# EAGLE design Stazione_Meteo (EAGLE 7.4.0)
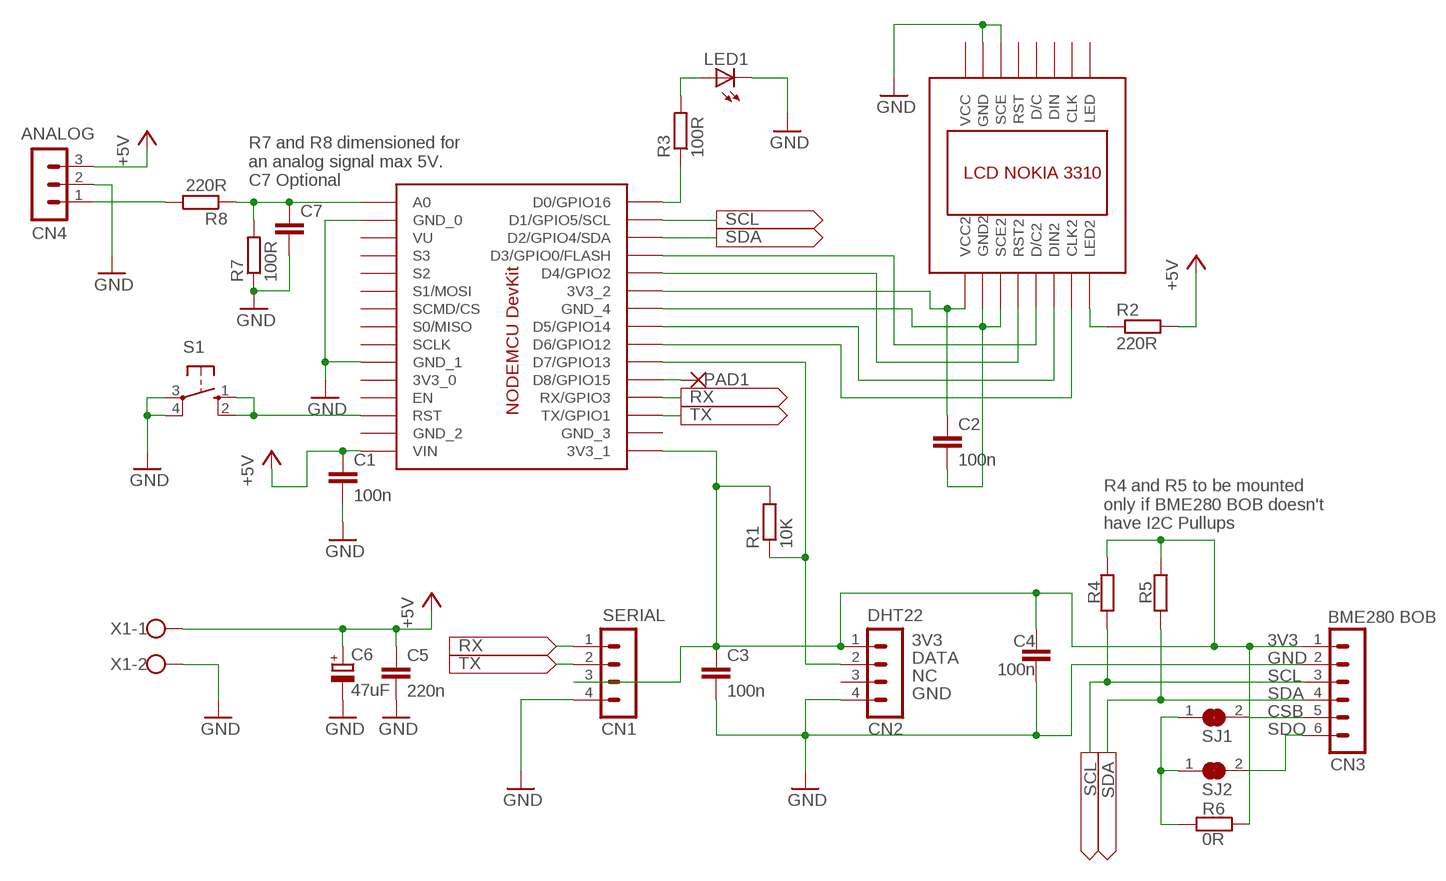
[diagram p0: schematic, sheet 1]

## Parts
C1  100n  C-EU025-024X044  [C025-024X044]
C2  100n  C-EU025-024X044  [C025-024X044]
C3  100n  C-EU025-024X044  [C025-024X044]
C4  100n  C-EU025-024X044  [C025-024X044]
C5  220n  C-EU025-024X044  [C025-024X044]
C6  47uF  CPOL-EUE2,5-6E  [E2,5-6E]
C7  C-EU025-024X044  [C025-024X044]
CN1  MA04-1  [MA04-1]
CN2  MA04-1  [MA04-1]
CN3  MA06-1  [MA06-1]
CN4  MA03-1  [MA03-1]
LED1  LED5MM  [LED5MM]
PAD1  1,6/0,9  [1,6/0,9]
R1  10K  R-EU_0204/7  [0204/7]
R2  220R  R-EU_0204/7  [0204/7]
R3  100R  R-EU_0204/7  [0204/7]
R4  R-EU_0204/7  [0204/7]
R5  R-EU_0204/7  [0204/7]
R6  0R  R-EU_0204/7  [0204/7]
R7  100R  R-EU_0204/7  [0204/7]
R8  220R  R-EU_0204/7  [0204/7]
S1  10-XX  [B3F-10XX]
SJ1  SJ  [SJ]
SJ2  SJ  [SJ]
U$1  NODEMCU_DEVKIT  [NODEMCU_DEVKIT]
U$2  NOKIA_3310/5110_BOB  [NOKIA_3310/5110_BOB]
X1  W237-102  [W237-102]

## Nets
+5V: C1.1 C5.1 C6.+ CN4.3 R2.2 U$1.VIN X1.1
GND: C1.2 C3.2 C4.2 C5.2 C6.- C7.2 CN1.4 CN2.4 CN3.2 CN4.2 LED1.K(C) R7.1 S1.3(P) S1.4(P1) U$1.GND0(GND_0) U$1.GND1(GND_1) U$2.GND U$2.SCE X1.2
N$1: R3.1 U$1.D0/GPIO16
N$2: LED1.A R3.2
N$3: CN2.2 R1.1 U$1.D7/GPIO13
N$4: S1.1(S) S1.2(S1) U$1.RST
N$6: R2.1 U$2.LED2
N$7: U$1.D5/GPIO14 U$2.DIN2
N$8: U$1.D3/GPIO0(D3/GPIO0/FLASH) U$2.D/C2
N$9: U$1.D4/GPIO2 U$2.RST2
N$10: C2.1 U$1.3V3_2 U$2.VCC2
N$11: U$1.D6/GPIO12 U$2.CLK2
N$12: R6.2 SJ1.1 SJ2.1
N$13: C2.2 U$1.GND4(GND_4) U$2.GND2 U$2.SCE2
N$14: PAD1.1(P) U$1.D8/GPIO15
N$15: CN3.5 SJ1.2
N$16: CN3.6 SJ2.2
N$19: C3.1 C4.1 CN1.3 CN2.1 CN3.1 R1.2 R4.2 R5.2 R6.1 U$1.3V3_1
N$21: CN4.1 R8.2
N$23: C7.1 R7.2 R8.1 U$1.A0
RX: CN1.1 U$1.RX/GPIO3
SCL: CN3.3 R4.1 U$1.D1/GPIO5(D1/GPIO5/SCL)
SDA: CN3.4 R5.1 U$1.D2/GPIO4(D2/GPIO4/SDA)
TX: CN1.2 U$1.TX/GPIO1
Unconnected: CN2.3 U$1.EN U$1.S0(S0/MISO) U$1.S1(S1/MOSI) U$1.S2 U$1.S3 U$1.SC(SCLK) U$1.SK(SCMD/CS) U$1.VU U$2.CLK U$2.D/C U$2.DIN U$2.RST

## Notes on the sheet
- ANALOG
- R7 and R8 dimensioned for
  an analog signal max 5V.
  C7 Optional
- R4 and R5 to be mounted
  only if BME280 BOB doesn't
  have I2C Pullups
- SERIAL | DHT22 | BME280 BOB
- 3V3 | 3V3
- DATA | GND
- NC | SCL
- GND | SDA
- CSB
- SDO

## Power pins joined to a net without a drawn wire
3V3_0: U$1.3V3_0
GND_2: U$1.GND2(GND_2)
GND_3: U$1.GND3(GND_3)
LED: U$2.LED
VCC: U$2.VCC

## Library data of the parts
C1-C5 C7 = rcl:C-EU: CAPACITOR, European symbol
C6 = rcl:CPOL-EU: POLARIZED CAPACITOR, European symbol
CN1 CN2 = con-lstb:MA04-1: PIN HEADER; OC_FARNELL: unknown; OC_NEWARK: unknown
CN3 = con-lstb:MA06-1: PIN HEADER; OC_FARNELL: unknown; OC_NEWARK: unknown
CN4 = con-lstb:MA03-1: PIN HEADER; OC_FARNELL: unknown; OC_NEWARK: unknown
LED1 = led:LED: LED OSRAM: - CHIPLED LG R971, LG N971, LY N971, LG Q971, LY Q971, LO R971, LY R971 LH N974, LH R974 LS Q976, LO Q976, LY Q976 LO Q996 - Hyper CHIPLED LW Q18S LB Q993, LB Q99A, LB R99A - SideLED LS A670, LO A670, LY A670, LG A670, LP A670 LB A673, LV A673, LT A673, LW A673 LH A674 LY A675 LS A676, LA A676, LO A676, LY A676, LW A676 LS A679, LY A679, LG A679 - Hyper Micro SIDELED® LS Y876, LA Y876, LO Y876, LY Y876 LT Y87S - SmartLED LW L88C, LW L88S LB L89C, LB L89S, LG L890 LS L89K, LO L89K, LY L89K LS L896, LA L896, LO L896, LY L896 - TOPLED LS T670, LO T670, LY T670, LG T670, LP T670 LSG T670, LSP T670, LSY T670, LOP T670, LYG T670 LG T671, LOG T671, LSG T671 LB T673, LV T673, LT T673, LW T673 LH T674 LS T676, LA T676, LO T676, LY T676, LB T676, LH T676, LSB T676, LW T676 LB T67C, LV T67C, LT T67C, LS T67K, LO T67K, LY T67K, LW E67C LS E67B, LA E67B, LO E67B, LY E67B, LB E67C, LV E67C, LT E67C LW T67C LS T679, LY T679, LG T679 LS T770, LO T770, LY T770, LG T770, LP T770 LB T773, LV T773, LT T773, LW T773 LH T774 LS E675, LA E675, LY E675, LS T675 LS T776, LA T776, LO T776, LY T776, LB T776 LHGB T686 LT T68C, LB T68C - Hyper Mini TOPLED® LB M676 - Mini TOPLED Santana® LG M470 LS M47K, LO M47K, LY M47K Source: http://www.osram.convergy.de LUXEON: - LUMILED® LXK2-PW12-R00, LXK2-PW12-S00, LXK2-PW14-U00, LXK2-PW14-V00 LXK2-PM12-R00, LXK2-PM12-S00, LXK2-PM14-U00 LXK2-PE12-Q00, LXK2-PE12-R00, LXK2-PE12-S00, LXK2-PE14-T00, LXK2-PE14-U00 LXK2-PB12-K00, LXK2-PB12-L00, LXK2-PB12-M00, LXK2-PB14-N00, LXK2-PB14-P00, LXK2-PB14-Q00 LXK2-PR12-L00, LXK2-PR12-M00, LXK2-PR14-Q00, LXK2-PR14-R00 LXK2-PD12-Q00, LXK2-PD12-R00, LXK2-PD12-S00 LXK2-PH12-R00, LXK2-PH12-S00 LXK2-PL12-P00, LXK2-PL12-Q00, LXK2-PL12-R00 Source: www.luxeon.com KINGBRIGHT: KA-3528ASYC Source: www.kingbright.com
PAD1 = wirepad:1,6/0,9: THROUGH-HOLE PAD
R1-R8 = rcl:R-EU_: RESISTOR, European symbol
S1 = switch-omron:10-XX: OMRON SWITCH; MPN: B3F-1000; OC_FARNELL: 176432; OC_NEWARK: 36M3542
SJ1 SJ2 = jumper:SJ: SMD solder JUMPER
U$1 = NodeMCU_devkit:NODEMCU_DEVKIT: NodeMCU LUA Devkit Version 0.1 Type 30x57mm with CH340G serial adapter Design by Giovanni Bernardo www.settorezero.com
U$2 = LCD_NOKIA_3310-5110_BreakoutBoard:NOKIA_3310/5110_BOB: LCD NOKIA 3310/5110 Breakout Board PCD8544 Controller Design by Giovanni Bernardo www.settorezero.com
X1 = con-wago-500:W237-102: WAGO SCREW CLAMP; MPN: 237-102; OC_FARNELL: unknown; OC_NEWARK: 70K9898

## Board
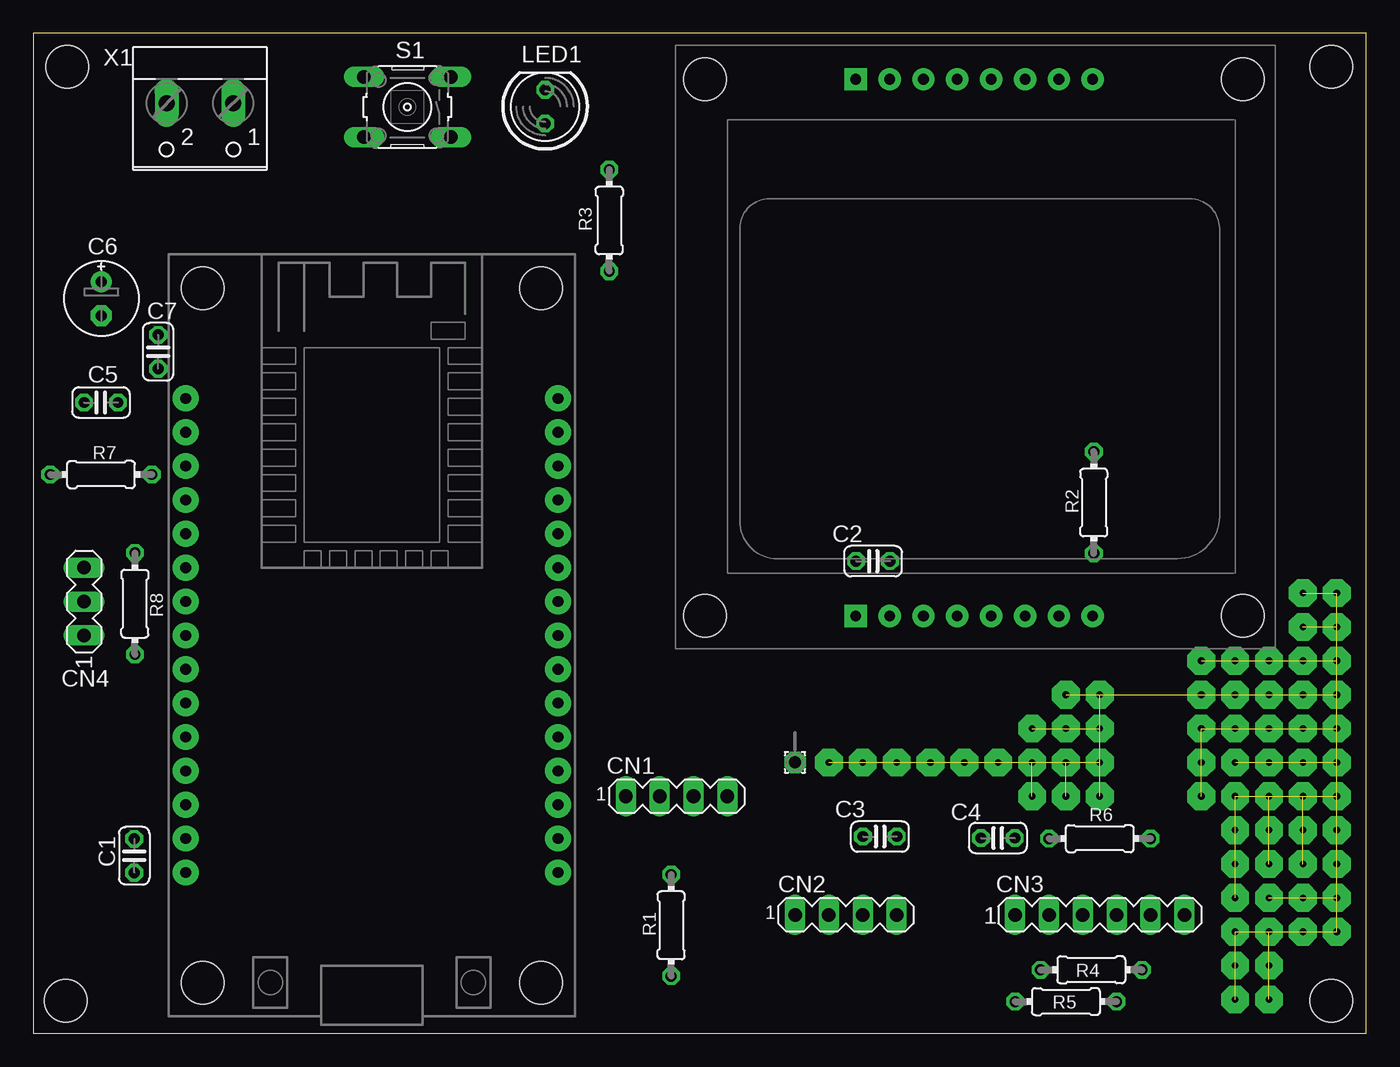
[diagram p1: board, top side]
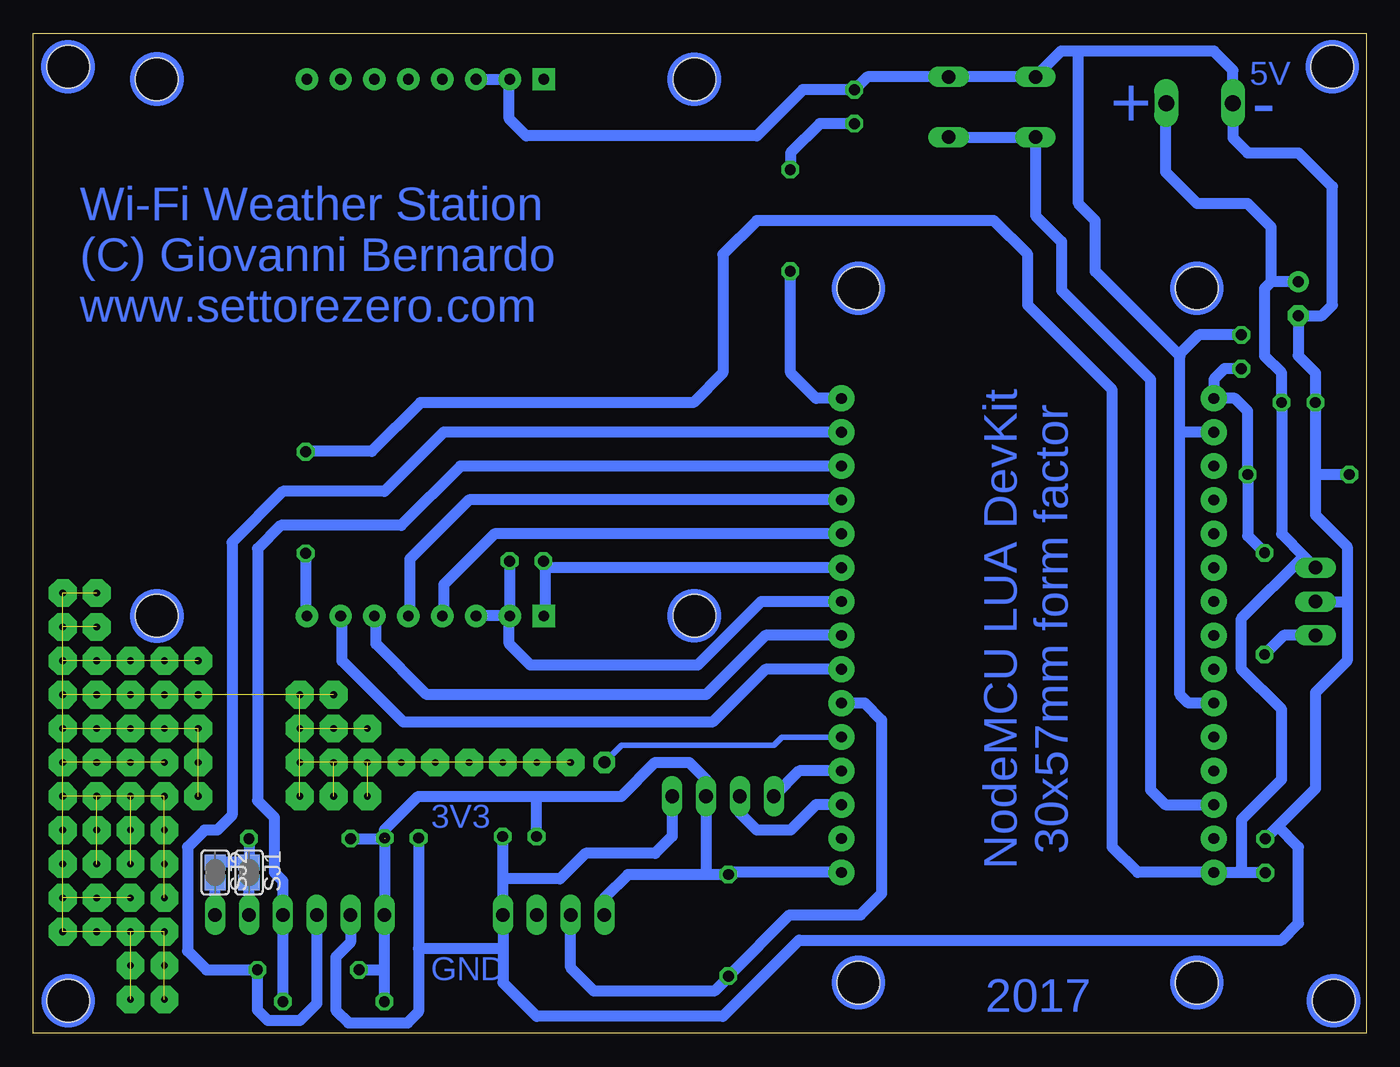
[diagram p2: board, bottom side, seen from below]

Size 100 x 75 mm. Coordinates in mm from the lower left corner, seen from the top.
Outline: 0,0 100,0 100,75 0,75 0,0
Copper layers (1*16): Top 0.035mm / dielectric 1.5mm / Bottom 0.035mm
Design rules "default": minimum track width 10mil, minimum drill 24mil, track to track 8mil, track to pad 8mil, pad to pad 8mil, via to via 8mil, smd to smd 8mil, copper to edge 40mil, drill to drill 8mil, minimum pad ring 10mil, minimum via ring 8mil, stop-mask expansion 4mil, vias tented up to drill 0mil, thermal gap 10mil
Holes 3.2 mm at 2.54,72.49 2.44,2.44 97.39,2.44 97.39,72.49

### Footprints (pad centres in the part's own frame; a part is rotated, then mirrored left to right if it is on the bottom)
C025-024X044 = drill 0.813 octagon: 1 -1.27,0; 2 1.27,0
E2,5-6E = drill 0.813 pad 1.575: + -1.27,0 | drill 0.813 pad 1.575 octagon: - 1.27,0
MA04-1 = drill 1.016 long: 1 -3.81,0; 2 -1.27,0; 3 1.27,0; 4 3.81,0
MA06-1 = drill 1.016 long: 1 -6.35,0; 2 -3.81,0; 3 -1.27,0; 4 1.27,0; 5 3.81,0; 6 6.35,0
MA03-1 = drill 1.016 long: 1 -2.54,0; 2 0,0; 3 2.54,0
LED5MM = drill 0.813 octagon: A -1.27,0; K 1.27,0
1,6/0,9 = drill 0.914 pad 1.6 octagon: 1 0,0
0204/7 = drill 0.813 octagon: 1 -3.81,0; 2 3.81,0
B3F-10XX = drill 1.016 long: 1 -3.251,2.261; 2 3.251,2.261; 3 -3.251,-2.261; 4 3.251,-2.261
SJ = smd 1.168 x 1.6: 1 -0.762,0; 2 0.762,0
NODEMCU_DEVKIT = drill 0.8 pad 1.93: 3V3_0 1.27,-36.195; 3V3_1 29.21,-46.355; 3V3_2 29.21,-23.495; A0 1.27,-10.795; D0/GPIO16 29.21,-10.795; D1/GPIO5 29.21,-13.335; D2/GPIO4 29.21,-15.875; D3/GPIO0 29.21,-18.415; D4/GPIO2 29.21,-20.955; D5/GPIO14 29.21,-28.575; D6/GPIO12 29.21,-31.115; D7/GPIO13 29.21,-33.655; D8/GPIO15 29.21,-36.195; EN 1.27,-38.735; GND0 1.27,-13.335; GND1 1.27,-33.655; GND2 1.27,-43.815; GND3 29.21,-43.815; GND4 29.21,-26.035; RST 1.27,-41.275; RX/GPIO3 29.21,-38.735; S0 1.27,-28.575; S1 1.27,-23.495; S2 1.27,-20.955; S3 1.27,-18.415; SC 1.27,-26.035; SK 1.27,-31.115; TX/GPIO1 29.21,-41.275; VIN 1.27,-46.355; VU 1.27,-15.875 | hole 3.2: 2.54,-2.54; 27.94,-2.54; 27.94,-54.61; 2.54,-54.61
NOKIA_3310/5110_BOB = drill 0.8 pad 1.676: CLK 27.94,-2.54; CLK2 27.94,-42.795; D/C 22.86,-2.54; D/C2 22.86,-42.795; DIN 25.4,-2.54; DIN2 25.4,-42.795; GND 15.24,-2.54; GND2 15.24,-42.795; LED 30.48,-2.54; LED2 30.48,-42.795; RST 20.32,-2.54; RST2 20.32,-42.795; SCE 17.78,-2.54; SCE2 17.78,-42.795 | drill 0.8 pad 1.676 square: VCC 12.698,-2.54; VCC2 12.698,-42.795 | hole 3.2: 1.405,-2.54; 41.727,-2.54; 1.405,-42.795; 41.727,-42.795
W237-102 = drill 1.194 long: 1 -2.5,-1.27; 2 2.5,-1.27

### Placement (x,y rotation side)
C1  7.57,13.32 90 top
C2  63,35.41 0 top
C3  63.52,14.76 0 top
C4  72.37,14.65 180 top
C5  5.08,47.31 180 top
C6  5.1,55.1 270 top
C7  9.37,51.12 90 top
CN1  48.26,17.78 0 top
CN2  60.96,8.89 0 top
CN3  80.01,8.89 0 top
CN4  3.81,32.38 90 top
LED1  38.4,69.5 90 top
PAD1  57.15,20.32 0 top
R1  47.86,8.1 90 top
R2  79.56,39.81 90 top
R3  43.21,60.97 90 top
R4  79.38,4.76 180 top
R5  77.47,2.38 180 top
R6  80.01,14.61 0 top
R7  5.08,41.91 0 top
R8  7.62,32.23 270 top
S1  28.06,69.48 180 top
SJ1  83.82,12.06 270 bottom
SJ2  86.36,12.06 270 bottom
U$1  10.16,58.42 0 top
U$2  49,74.1 0 top
X1  12.5,68.5 180 top

### Tracks (layer width: path | path; a pad name or v marks a point on that pad's centre or on a via)
+5V
  Bottom 0.813: C1.1 9.68,12.05 | 9.68,12.05 11.41,12.05 U$1.VIN 17.14,12.06 19.05,13.97 19.05,48.26 25.4,54.61 25.4,58.42 27.94,60.96 45.72,60.96 48.26,58.42 48.26,49.53 50.48,47.31 70.96,47.31 74.61,43.66 79.53,43.66 R2.2 | 9.68,12.05 9.37,12.37 9.37,16.03 6.35,19.05 6.35,24.29 9.37,27.3 9.37,31.11 4.68,35.8 | 4.68,35.8 6.35,37.47 C5.1 6.35,49.53 7.62,50.8 7.62,55.88 7.13,56.37 | 4.68,35.8 CN4.3 | C6.+ 7.13,56.37 | 7.13,56.37 7.13,60.47 8.89,62.23 12.68,62.23 15.04,64.59 15.04,69.73 X1.1
GND
  Bottom 0.813: 21.59,73.66 11.43,73.66 10,72.23 X1.2 10,67.15 8.89,66.04 5.08,66.04 2.54,63.5 2.54,54.61 3.32,53.83 C6.- 5.1,50.82 3.81,49.53 C5.2 3.81,41.91 | 21.59,73.66 22.89,73.66 S1.4 S1.3 37.43,71.74 LED1.K 42.26,70.77 45.72,67.31 63.02,67.31 64.29,68.58 64.29,71.51 U$2.GND U$2.SCE | 64.77,6.35 CN2.4 64.79,8.91 64.79,11.43 | 64.77,6.35 64.77,3.81 62.23,1.27 48.26,1.27 42.55,6.99 6.35,6.99 5.08,8.26 5.08,13.97 6.63,15.52 | C3.2 64.79,11.43 | CN1.4 52.07,14.76 53.34,13.49 58.58,13.49 60.48,11.59 64.63,11.59 64.79,11.43 | C4.2 71.1,6.35 | 71.1,6.35 71.1,1.61 71.91,0.79 76.36,0.79 77.31,1.75 77.31,5.71 76.2,6.83 CN3.2 76.23,8.92 | 64.77,6.35 71.1,6.35 | 14.05,50.88 13.97,50.8 13.97,45.09 | 14.05,50.88 20.32,57.15 20.32,60.96 21.59,62.23 21.59,73.66 | U$1.GND1 13.34,24.77 13.97,25.4 13.97,45.09 | R7.1 3.81,41.91 | 3.81,41.91 3.81,38.89 1.43,36.51 1.43,32.38 | 1.43,32.38 1.43,27.94 3.81,25.56 3.81,18.35 6.63,15.52 | 6.63,15.52 C1.2 | CN4.2 1.43,32.38 | U$1.GND0 13.97,45.09 | C7.2 12.54,52.39 14.05,50.88
N$1
  Bottom 0.813: U$1.D0/GPIO16 41.27,47.62 43.18,49.53 43.18,57.13 R3.1
N$2
  Bottom 0.813: LED1.A 40.99,68.23 43.18,66.04 43.18,64.81 R3.2
N$3
  Bottom 0.813: U$1.D7/GPIO13 37.62,24.77 36.35,23.5 36.35,10.48 37.94,8.89 43.26,8.89 R1.1 47.86,4.21 48.9,3.17 57.94,3.17 59.69,4.92 CN2.2
N$4
  Bottom 0.813: S1.1 S1.2 24.81,61.33 22.86,59.37 22.86,55.72 16.19,49.05 16.19,18.26 15.08,17.14 U$1.RST
N$6
  Bottom 0.813: R2.1 79.56,31.39 U$2.LED2
N$7
  Bottom 0.813: U$1.D5/GPIO14 45.09,29.84 49.53,25.4 70.48,25.4 74.3,29.21 74.3,31.2 U$2.DIN2
N$8
  Bottom 0.813: U$1.D3/GPIO0 67.31,40.01 71.75,35.56 71.75,31.41 U$2.D/C2
N$9
  Bottom 0.813: U$1.D4/GPIO2 65.41,37.47 69.22,33.66 69.22,31.41 U$2.RST2
N$10
  Bottom 0.813: U$1.3V3_2 61.24,34.92 C2.1 61.61,35.41 61.61,31.39 U$2.VCC2
N$11
  Bottom 0.813: U$1.D6/GPIO12 45.09,27.3 49.05,23.34 72.23,23.34 76.83,27.94 76.83,31.2 U$2.CLK2
N$12
  Bottom 0.813: R6.2 SJ1.1 SJ2.1
N$13
  Bottom 0.813: 64.77,31.3 U$2.GND2 64.27,31.34 C2.2 | 64.77,31.3 U$2.SCE2 | U$1.GND4 45.4,32.38 50.16,27.62 62.71,27.62 64.29,29.21 64.29,30.83 64.77,31.3
N$14
  Bottom 0.406: U$1.D8/GPIO15 43.81,22.23 44.45,21.59 55.88,21.59 PAD1.1
N$15
  Bottom 0.813: CN3.5 SJ1.2
N$16
  Bottom 0.813: CN3.6 SJ2.2
N$17
  Bottom 0.406: 83.82,11.43 83.82,12.7
N$18
  Bottom 0.406: 86.36,11.43 86.36,12.7
N$19  (1 unrouted)
  Bottom 0.813: U$1.3V3_1 47.7,12.06 R1.2 49.53,11.91 | 49.53,11.91 55.4,11.91 57.15,10.16 CN2.1 | 49.53,11.91 CN1.3 49.53,19.05 50.8,20.32 53.34,20.32 55.88,17.78 62.23,17.78 | R5.2 73.66,5.08 | 73.66,5.08 CN3.1 73.64,7.64 C4.1 73.64,15.26 71.12,17.78 62.23,17.78 | R4.2 73.98,4.76 73.66,5.08 | C3.1 62.25,17.76 62.23,17.78 | R6.1 73.66,14.61 73.66,15.24
N$20  (via drill 0.5 pad 2.08)  (65 unrouted)
  other vias: 59.69,20.32 62.23,20.32 64.77,20.32 67.31,20.32 69.85,20.32 72.39,20.32 74.93,20.32 77.47,20.32 80.01,20.32 80.01,22.86 77.47,22.86 74.93,22.86 74.93,17.78 77.47,17.78 80.01,17.78 87.63,22.86 87.63,20.32 87.63,17.78 90.17,17.78 92.71,17.78 95.25,17.78 97.79,17.78 97.79,20.32 95.25,20.32 92.71,20.32 90.17,20.32 90.17,22.86 92.71,22.86 95.25,22.86 97.79,22.86 87.63,25.4 90.17,25.4 92.71,25.4 95.25,25.4 97.79,25.4 95.25,27.94 97.79,27.94 90.17,15.24 92.71,15.24 95.25,15.24 97.79,15.24 90.17,12.7 97.79,12.7 97.79,10.16 97.79,7.62 95.25,7.62 92.71,7.62 90.17,7.62 90.17,10.16 92.71,10.16 95.25,10.16 95.25,12.7 92.71,12.7 90.17,5.08 90.17,2.54 92.71,2.54 92.71,5.08 95.25,30.48 97.79,30.48 77.47,25.4 80.01,25.4 92.71,27.94 90.17,27.94 87.63,27.94 95.25,33.02 97.79,33.02
N$21
  Bottom 0.813: CN4.1 6.19,29.84 R8.2
N$23
  Bottom 0.813: R8.1 8.89,37.31 R7.2 8.89,46.67 9.84,47.62 U$1.A0 11.43,49.05 10.64,49.85 C7.1
RX
  Bottom 0.813: U$1.RX/GPIO3 42.55,19.68 CN1.1
SCL
  Bottom 0.813: U$1.D1/GPIO5 69.22,45.09 73.66,40.64 81.28,40.64 85.09,36.83 85.09,16.35 86.2,15.24 87.15,15.24 88.42,13.97 88.42,6.19 87,4.76 R4.1 83.19,1.75 82.39,0.95 80.01,0.95 78.74,2.22 CN3.3
SDA
  Bottom 0.813: U$1.D2/GPIO4 67.94,42.55 72.39,38.1 81.44,38.1 83.19,36.35 83.19,17.46 81.92,16.19 81.92,12.06 81.28,11.43 CN3.4 R5.1
TX
  Bottom 0.813: U$1.TX/GPIO1 41.27,17.14 43.18,15.24 45.72,15.24 46.99,16.51 CN1.2
(copper drawn outside any net)
  shapes: Bottom circle x12

### Text on the board
Bottom: 5V | - | + | Wi-Fi Weather Station | (C) Giovanni Bernardo | www.settorezero.com | NodeMCU LUA DevKit / 30x57mm form factor | 3V3 | 2017 | GND
tDocu: + | NOKIA3310 LCD Breakout Board | NODEMCU LUA Devkit | ANALOG | +5 | G | A0 | D8/GPIO15 | SERIAL | RX | TX | 3V3 | GND | DHT22 | BME280 | 3V3 | SCL | SDA | GND | NC | 3V3 | GND | DATA